# Altium schematic sheet S7CAS-PLEIADES-CARTE-MERE_P06_MISC.SchDoc
size Tabloid; SheetNumber: 14; SheetTotal: 18; Sheet_Name: MISC; Size: 11x17
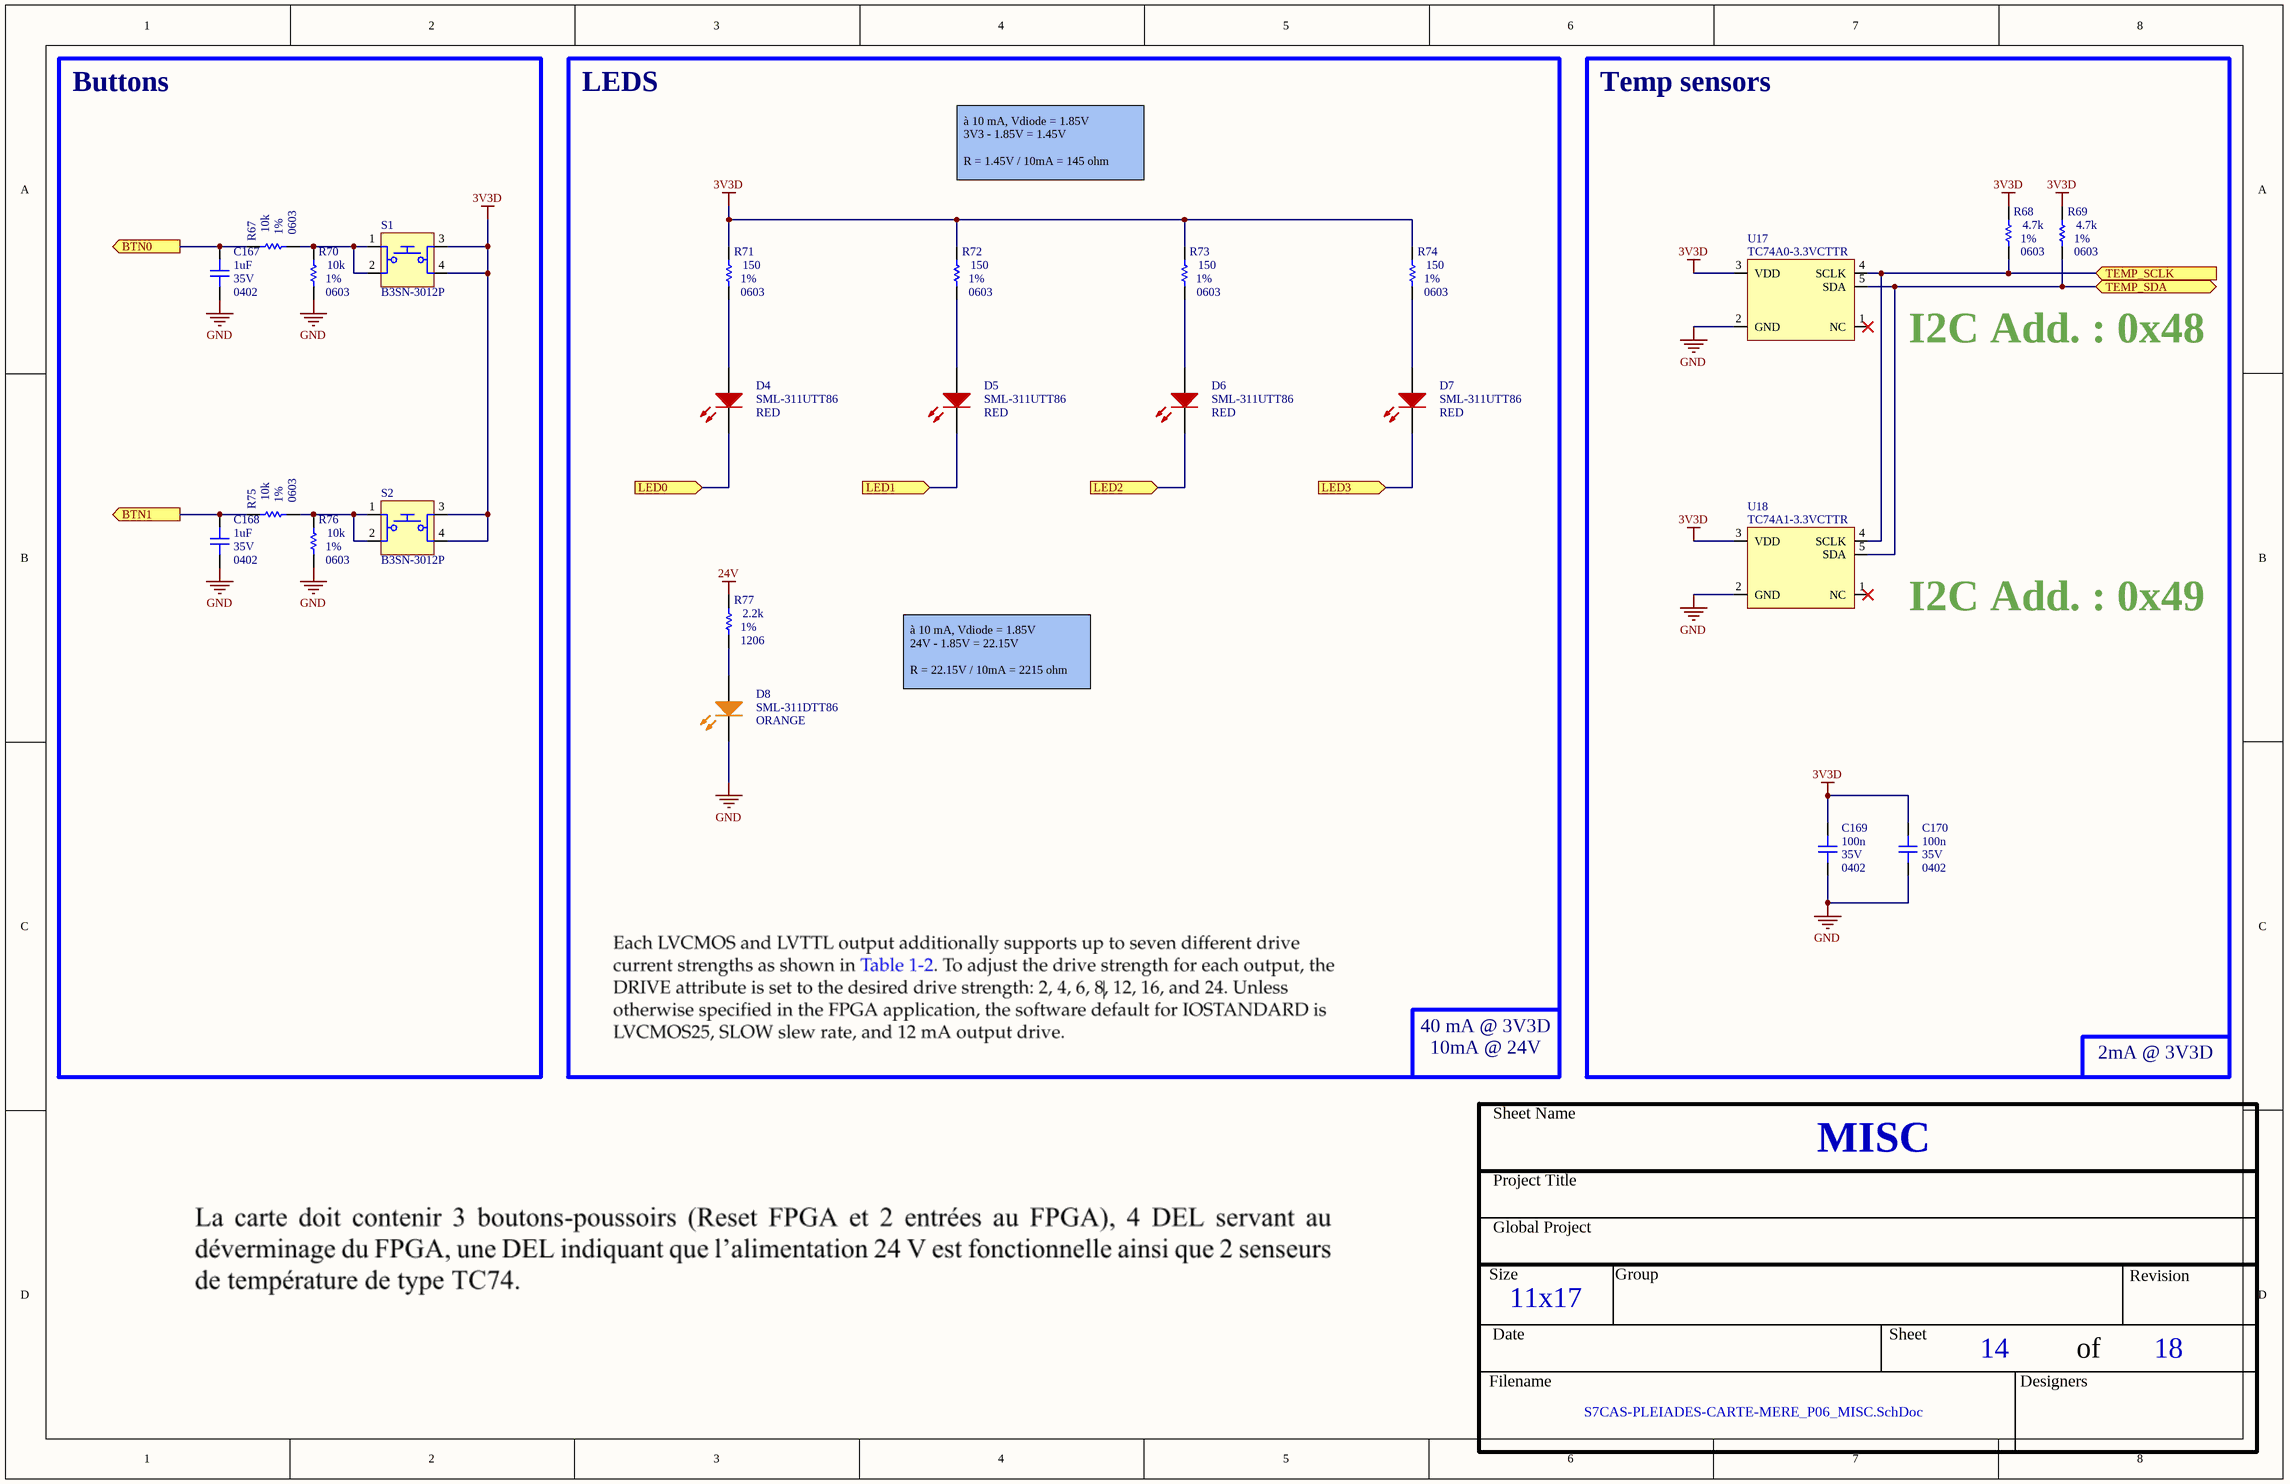
[diagram p0: S7CAS-PLEIADES-CARTE-MERE_P06_MISC.SchDoc]

## Parts
C167  value 1uF  Voltage: 35V  Package: 0402  [CAP_0402]  (hidden comment: CAP - 0402)
C168  value 1uF  Voltage: 35V  Package: 0402  [CAP_0402]  (hidden comment: CAP - 0402)
C169  value 100n  Voltage: 35V  Package: 0402  [CAP_0402]  (hidden comment: CAP - 0402)
C170  value 100n  Voltage: 35V  Package: 0402  [CAP_0402]  (hidden comment: CAP - 0402)
D4  SML-311UTT86  value RED  [LED_0603]
D5  SML-311UTT86  value RED  [LED_0603]
D6  SML-311UTT86  value RED  [LED_0603]
D7  SML-311UTT86  value RED  [LED_0603]
D8  SML-311DTT86  value ORANGE  [LED_0603]
R67  value 10k  Package: 0603  Precision: 1%  [RES_0603]  (hidden comment: RES - 0603)
R68  value 4.7k  Package: 0603  Precision: 1%  [RES_0603]  (hidden comment: RES - 0603)
R69  value 4.7k  Package: 0603  Precision: 1%  [RES_0603]  (hidden comment: RES - 0603)
R70  value 10k  Package: 0603  Precision: 1%  [RES_0603]  (hidden comment: RES - 0603)
R71  value 150  Package: 0603  Precision: 1%  [RES_0603]  (hidden comment: RES - 0603)
R72  value 150  Package: 0603  Precision: 1%  [RES_0603]  (hidden comment: RES - 0603)
R73  value 150  Package: 0603  Precision: 1%  [RES_0603]  (hidden comment: RES - 0603)
R74  value 150  Package: 0603  Precision: 1%  [RES_0603]  (hidden comment: RES - 0603)
R75  value 10k  Package: 0603  Precision: 1%  [RES_0603]  (hidden comment: RES - 0603)
R76  value 10k  Package: 0603  Precision: 1%  [RES_0603]  (hidden comment: RES - 0603)
R77  value 2.2k  Package: 1206  Precision: 1%  [RES_1206]  (hidden comment: RES - 1206)
S1  B3SN-3012P  [SWI_TACT_B3SN-3012P]
S2  B3SN-3012P  [SWI_TACT_B3SN-3012P]
U17  TC74A0-3.3VCTTR  [SEN_TEMP_TC74A0-3.3VCTTR]
U18  TC74A1-3.3VCTTR  [SEN_TEMP_TC74A0-3.3VCTTR]

## Blocks framed on the sheet
Buttons: C167 C168 R67 R70 R75 R76 S1 S2
LEDS: D4-D8 R71-R74 R77

## Ports
BTN0 (out, see S7CAS-PLEIADES-CARTE-MERE_P06_FPGA1[3B]), BTN1 (out, see S7CAS-PLEIADES-CARTE-MERE_P06_FPGA1[3B]), LED0 (in, see S7CAS-PLEIADES-CARTE-MERE_P06_FPGA1[3B]), LED1 (in, see S7CAS-PLEIADES-CARTE-MERE_P06_FPGA1[3B]), LED2 (in, see S7CAS-PLEIADES-CARTE-MERE_P06_FPGA1[3B]), LED3 (in, see S7CAS-PLEIADES-CARTE-MERE_P06_FPGA1[3B]), TEMP_SCLK (in, see S7CAS-PLEIADES-CARTE-MERE_P06_FPGA1[3B]), TEMP_SDA (bidir, see S7CAS-PLEIADES-CARTE-MERE_P06_FPGA1[3B])

## Nets
3V3D: C169.2 C170.2 R68.2 R69.2 R71.2 R72.2 R73.2 R74.2 S1.3 S1.4 S2.3 S2.4 U17.3(VDD) U18.3(VDD)
24V: R77.2
GND: C167.1 C168.1 C169.1 C170.1 D8.K R70.1 R76.1 U17.2(GND) U18.2(GND)
BTN0: C167.2 R67.2 ; port BTN0
BTN1: C168.2 R75.2 ; port BTN1
LED0: D4.K ; port LED0
LED1: D5.K ; port LED1
LED2: D6.K ; port LED2
LED3: D7.K ; port LED3
TEMP_SCLK: R68.1 U17.4(SCLK) U18.4(SCLK) ; port TEMP_SCLK
TEMP_SDA: R69.1 U17.5(SDA) U18.5(SDA) ; port TEMP_SDA
NetD4_A: D4.A R71.1
NetD5_A: D5.A R72.1
NetD6_A: D6.A R73.1
NetD7_A: D7.A R74.1
NetD8_A: D8.A R77.1
NetR67_1: R67.1 R70.2 S1.1 S1.2
NetR75_1: R75.1 R76.2 S2.1 S2.2

Not connected (* = marked no-connect by the designer): U17 1(NC)*; U18 1(NC)*

## Notes on the sheet
- Temp sensors
- à 10 mA, Vdiode = 1.85V
  3V3 - 1.85V = 1.45V
  R = 1.45V / 10mA = 145 ohm
- I2C Add. : 0x48
- I2C Add. : 0x49
- à 10 mA, Vdiode = 1.85V
  24V - 1.85V = 22.15V
  R = 22.15V / 10mA = 2215 ohm
- 40 mA @ 3V3D
  10mA @ 24V
- 2mA @ 3V3D
- Sheet Name
- Project Title
- Global Project
- Size
- Group
- Revision
- Date
- Sheet
- of
- Filename
- Designers

## Library data of the parts
C167-C170 = CAP - 0402: Precision: 10%; Current: *; CreatedBy: Jonathan Bouchard; Power: *
D4-D7 = LED_SML-311UTT86: LED - 620nM RED 2mA - 0603; Voltage: 1.8V; Mfg: ROHM Semiconductor; Power: 44mW; Current: 2mA; HelpURL: http://media.digikey.com/pdf/Data%20Sheets/Rohm%20PDFs/SML-311%20Series.pdf; CreatedBy: Jonathan Bouchard; Temperature: -30°C to 85°C; Package: 0603; Precision: *; Mfg Part Number: SML-311UTT86; Supplier 1: Digikey; Supplier Part Number 1: 511-1304-1-ND
D8 = LED_SML-311DTT86: LED - 611nM ORANGE 2mA - 0603; Voltage: 1.8V; Mfg: ROHM Semiconductor; Power: 44mW; Current: 2mA; HelpURL: http://media.digikey.com/pdf/Data%20Sheets/Rohm%20PDFs/SML-311%20Series.pdf; CreatedBy: Jonathan Bouchard; Temperature: -40°C to 85°C; Package: 0603; Precision: *; Mfg Part Number: SML-311DTT86; Supplier 1: Digikey; Supplier Part Number 1: 511-1303-1-ND
R77 = RES - 1206: Power: 0.4W; Current: *; CreatedBy: Jonathan Bouchard
S1 S2 = SWI_TACT_B3SN-3012P_1: SWI - SWITCH TACTILE SPST-NO 0.05A 24V -SMD; Manufacturer #1: Omron Electronics Inc-EMC Div; Current Rating: 50mA; Voltage rating: 24VDC; Polarized: No; Magnetic Material: UNKNOWN; GRAMS Lib Spec: 2.8; Manufacturer #2: *; Power Max: *; Value: SPST-NO; Part Number #1: B3SN-3012P; Part Number #2: *; HelpURL: http://omronfs.omron.com/en_US/ecb/products/pdf/en-b3sn.pdf; Supplier 1: Digi-Key; Supplier Part Number 1: SW261CT-ND; Assembly Type: SMD; Temperature: -25°C ~ 70°C; Package: SMD; CreatedBy/Date: Olivier Bernard / 5/12/2017; Tolerance: *; VerifiedBy: Caroline Paulin / 11 juillet 2018; Cryo: UNKNOWN
U17 U18 = SENS_TEMP_TC74A0-3.3VCTTR: SENS - TEMPERATURE SENSOR I2C/SMBUS - SOT23-5; Voltage: 2.7 V ~ 5.5 V; Mfg: Microchip; Precision: ±2°C (±3°C); Current: *; Power: *; Mfg Part Number: TC74A0-3.3VCTTR; HelpURL: http://ww1.microchip.com/downloads/en/DeviceDoc/21462D.pdf; CreatedBy: Jonathan Bouchard; Temperature: -40°C ~ 125°C; Value: *; Package: SOT23-5; Supplier 1: Digikey; Supplier Part Number 1: TC74A0-3.3VCTDKR-ND
R67-R76 = RES - 0603: Current: *; CreatedBy: Jonathan Bouchard